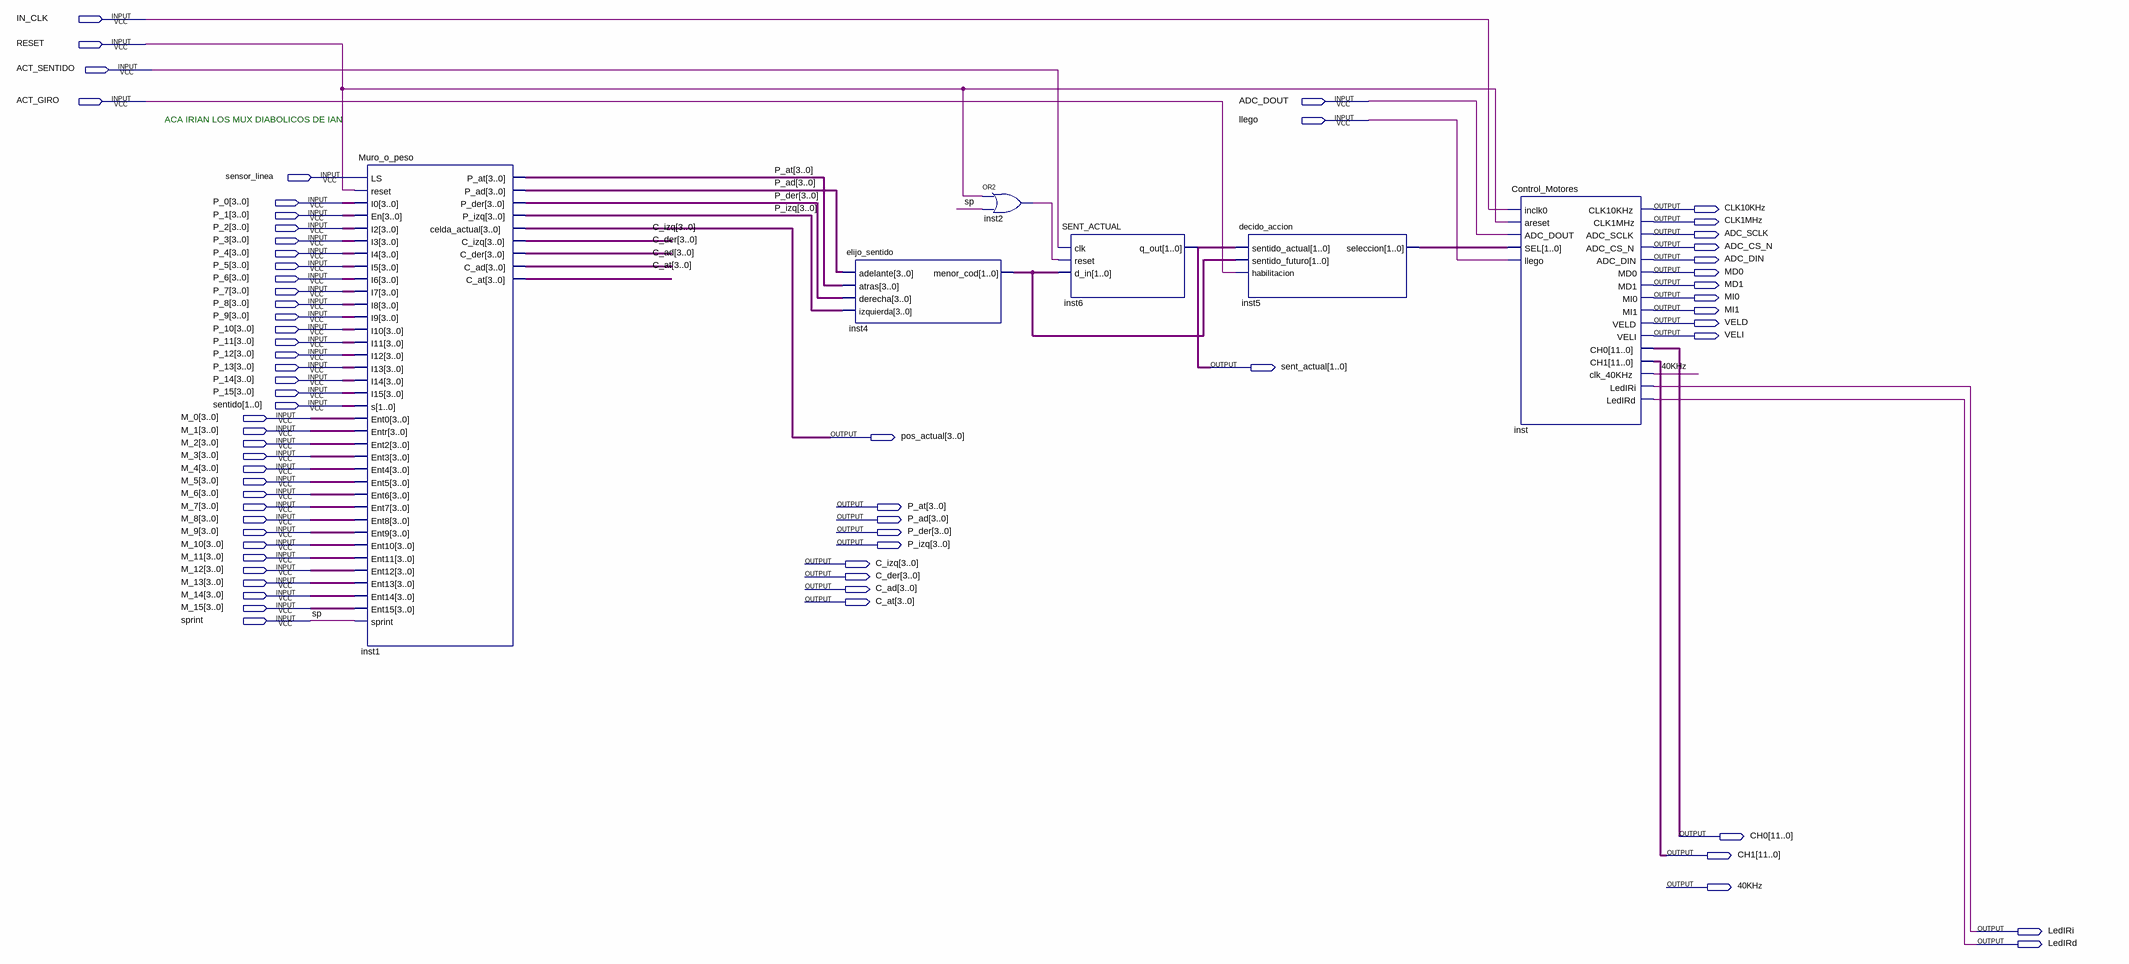
[diagram p0: schematic sheet]
// Quartus schematic algoritmo_decision.bdf as structural Verilog: 6 symbols, 67 pins
module algoritmo_decision (
  input  IN_CLK,
  input  RESET,
  input  ACT_SENTIDO,
  input  ACT_GIRO,
  input  ADC_DOUT,
  input  llego,
  input  sensor_linea,
  input  [3:0] P_0,
  input  [3:0] P_1,
  input  [3:0] P_2,
  input  [3:0] P_3,
  input  [3:0] P_4,
  input  [3:0] P_5,
  input  [3:0] P_6,
  input  [3:0] P_7,
  input  [3:0] P_8,
  input  [3:0] P_9,
  input  [3:0] P_10,
  input  [3:0] P_11,
  input  [3:0] P_12,
  input  [3:0] P_13,
  input  [3:0] P_14,
  input  [3:0] P_15,
  input  [1:0] sentido,
  input  [3:0] M_0,
  input  [3:0] M_1,
  input  [3:0] M_2,
  input  [3:0] M_3,
  input  [3:0] M_4,
  input  [3:0] M_5,
  input  [3:0] M_6,
  input  [3:0] M_7,
  input  [3:0] M_8,
  input  [3:0] M_9,
  input  [3:0] M_10,
  input  [3:0] M_11,
  input  [3:0] M_12,
  input  [3:0] M_13,
  input  [3:0] M_14,
  input  [3:0] M_15,
  input  sprint,
  output CLK10KHz,
  output CLK1MHz,
  output ADC_SCLK,
  output ADC_CS_N,
  output ADC_DIN,
  output MD0,
  output MD1,
  output MI0,
  output MI1,
  output VELD,
  output VELI,
  output [1:0] sent_actual,
  output [3:0] pos_actual,
  output [3:0] P_at,
  output [3:0] P_ad,
  output [3:0] P_der,
  output [3:0] P_izq,
  output [3:0] C_izq,
  output [3:0] C_der,
  output [3:0] C_ad,
  output [3:0] C_at,
  output [11:0] CH0,
  output [11:0] CH1,
  output \40KHz ,
  output LedIRi,
  output LedIRd
);

  wire inst2_out;
  wire [1:0] inst4_menor_cod, inst5_seleccion;

  Muro_o_peso inst1 (
    .LS(sensor_linea), .reset(RESET), .I0(P_0), .En(P_1), .I2(P_2), .I3(P_3), .I4(P_4), .I5(P_5), .I6(P_6),
    .I7(P_7), .I8(P_8), .I9(P_9), .I10(P_10), .I11(P_11), .I12(P_12), .I13(P_13), .I14(P_14), .I15(P_15),
    .s(sentido), .Ent0(M_0), .Entr(M_1), .Ent2(M_2), .Ent3(M_3), .Ent4(M_4), .Ent5(M_5), .Ent6(M_6),
    .Ent7(M_7), .Ent8(M_8), .Ent9(M_9), .Ent10(M_10), .Ent11(M_11), .Ent12(M_12), .Ent13(M_13), .Ent14(M_14),
    .Ent15(M_15), .sprint(sprint), .P_at(P_at), .P_ad(P_ad), .P_der(P_der), .P_izq(P_izq),
    .celda_actual(pos_actual), .C_izq(C_izq), .C_der(C_der), .C_ad(C_ad), .C_at(C_at));
  elijo_sentido inst4 (.adelante(P_ad), .atras(P_at), .derecha(P_der), .izquierda(P_izq), .menor_cod(inst4_menor_cod));
  or inst2 (inst2_out, RESET, sprint);
  SENT_ACTUAL inst6 (.clk(ACT_SENTIDO), .reset(inst2_out), .d_in(inst4_menor_cod), .q_out(sent_actual));
  decido_accion inst5 (
    .sentido_actual(sent_actual), .sentido_futuro(inst4_menor_cod), .habilitacion(ACT_GIRO),
    .seleccion(inst5_seleccion));
  Control_Motores inst (
    .inclk0(IN_CLK), .areset(RESET), .ADC_DOUT(ADC_DOUT), .SEL(inst5_seleccion), .llego(llego),
    .CLK10KHz(CLK10KHz), .CLK1MHz(CLK1MHz), .ADC_SCLK(ADC_SCLK), .ADC_CS_N(ADC_CS_N), .ADC_DIN(ADC_DIN),
    .MD0(MD0), .MD1(MD1), .MI0(MI0), .MI1(MI1), .VELD(VELD), .VELI(VELI), .CH0(CH0), .CH1(CH1),
    .clk_40KHz(\40KHz ), .LedIRi(LedIRi), .LedIRd(LedIRd));

  // Other names for the same wires on the sheet: sp = sprint

  // Notes on the sheet:
  //   ACA IRIAN LOS MUX DIABOLICOS DE IAN      
endmodule
